# Altium schematic sheet OTHER.SchDoc: OTHER
size A4; DrawnBy: ThanhQuoc; Revision: V01; SheetNumber: 21; SheetTotal: 21; Project: RV1126 CAMERA BOARD DESIGN
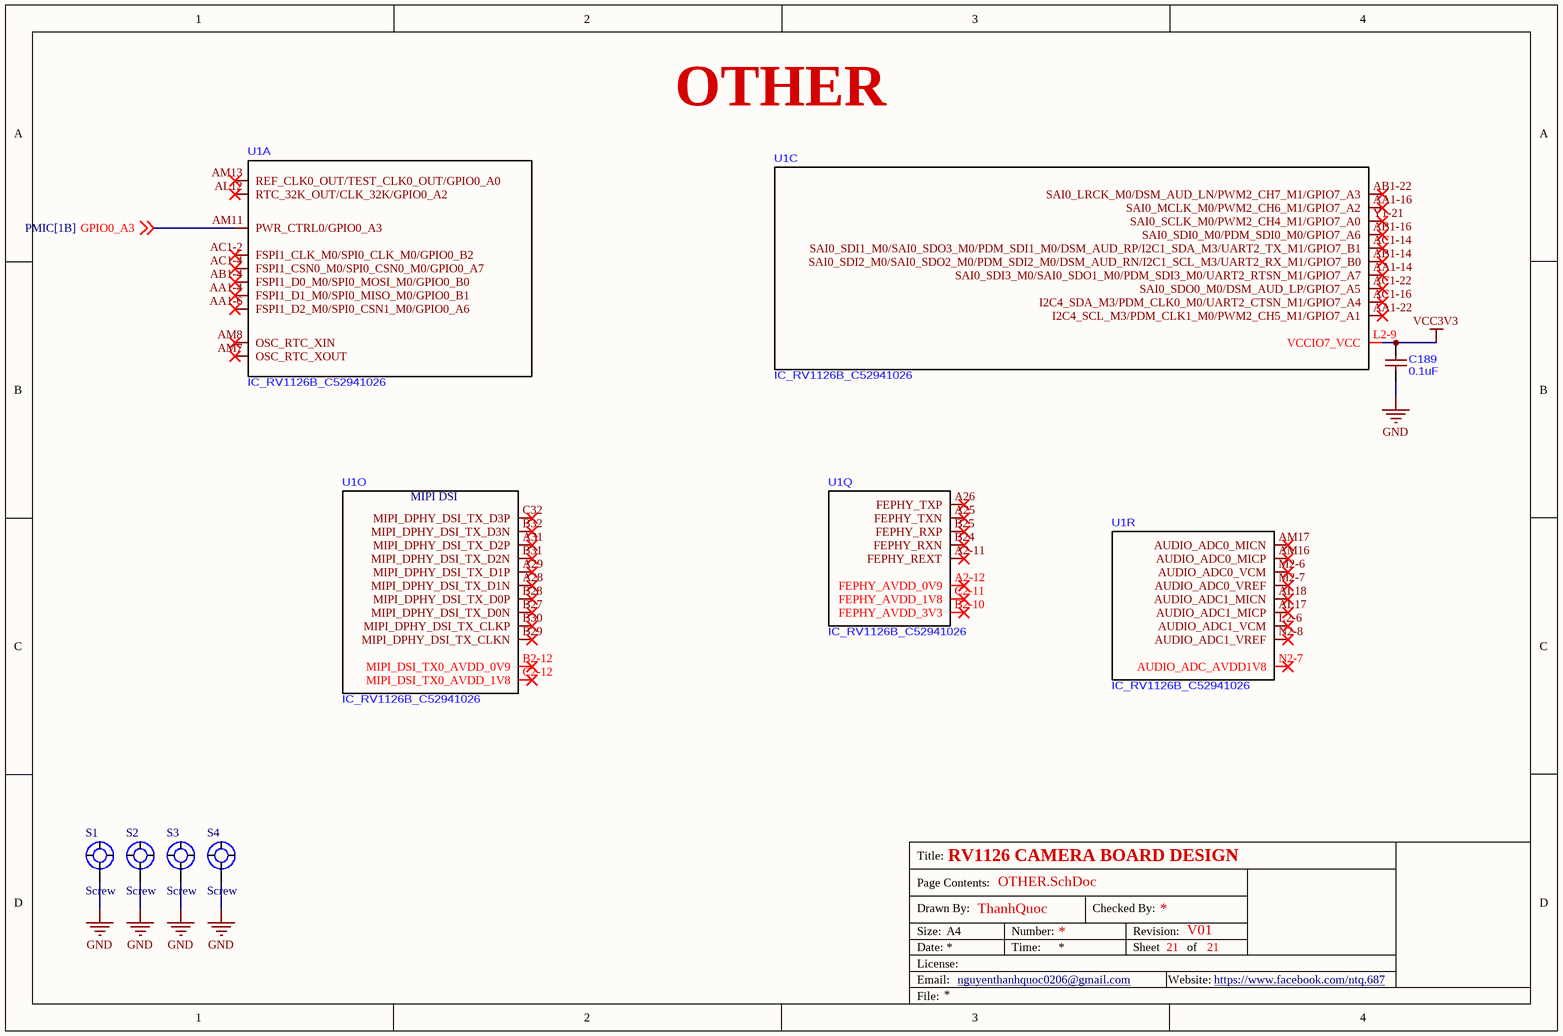
[diagram p0: OTHER.SchDoc]

## Parts
C189  0.1uF  [C0201]
S1  Screw  [SCREW 3.0]
S2  Screw  [SCREW 3.0]
S3  Screw  [SCREW 3.0]
S4  Screw  [SCREW 3.0]
U1  IC_RV1126B_C52941026  [CCSP-491_L14.0-W14.0-TL_RV1126B]  (parts A,C,O,Q,R of 18)

## Nets
GND: C189.1 S1.1 S2.1 S3.1 S4.1
VCC3V3: C189.2 U1.L2-9(VCCIO7_VCC)
GPIO0_A3: U1.AM11(PWR_CTRL0/GPIO0_A3) ; off-sheet GPIO0_A3

Not connected (* = marked no-connect by the designer): U1 A2-11(FEPHY_REXT)* A2-12(FEPHY_AVDD_0V9)* A25(FEPHY_TXN)* A26(FEPHY_TXP)* A28(MIPI_DPHY_DSI_TX_D1N)* A29(MIPI_DPHY_DSI_TX_D1P)* A31(MIPI_DPHY_DSI_TX_D2P)* AA1-4(FSPI1_D1_M0/SPI0_MISO_M0/GPIO0_B1)* AA1-6(FSPI1_D2_M0/SPI0_CSN1_M0/GPIO0_A6)* AA1-14(SAI0_SDI3_M0/SAI0_SDO1_M0/PDM_SDI3_M0/UART2_RTSN_M1/GPIO7_A7)* AA1-16(SAI0_MCLK_M0/PWM2_CH6_M1/GPIO7_A2)* AA1-22(I2C4_SCL_M3/PDM_CLK1_M0/PWM2_CH5_M1/GPIO7_A1)* AB1-4(FSPI1_D0_M0/SPI0_MOSI_M0/GPIO0_B0)* AB1-14(SAI0_SDI2_M0/SAI0_SDO2_M0/PDM_SDI2_M0/DSM_AUD_RN/I2C1_SCL_M3/UART2_RX_M1/GPIO7_B0)* AB1-16(SAI0_SDI0_M0/PDM_SDI0_M0/GPIO7_A6)* AB1-22(SAI0_LRCK_M0/DSM_AUD_LN/PWM2_CH7_M1/GPIO7_A3)* AC1-2(FSPI1_CLK_M0/SPI0_CLK_M0/GPIO0_B2)* AC1-4(FSPI1_CSN0_M0/SPI0_CSN0_M0/GPIO0_A7)* AC1-14(SAI0_SDI1_M0/SAI0_SDO3_M0/PDM_SDI1_M0/DSM_AUD_RP/I2C1_SDA_M3/UART2_TX_M1/GPIO7_B1)* AC1-16(I2C4_SDA_M3/PDM_CLK0_M0/UART2_CTSN_M1/GPIO7_A4)* AC1-22(SAI0_SDO0_M0/DSM_AUD_LP/GPIO7_A5)* AL12(RTC_32K_OUT/CLK_32K/GPIO0_A2)* AL17(AUDIO_ADC1_MICP)* AL18(AUDIO_ADC1_MICN)* AM7(OSC_RTC_XOUT)* AM8(OSC_RTC_XIN)* AM13(REF_CLK0_OUT/TEST_CLK0_OUT/GPIO0_A0)* AM16(AUDIO_ADC0_MICP)* AM17(AUDIO_ADC0_MICN)* B2-10(FEPHY_AVDD_3V3)* B2-12(MIPI_DSI_TX0_AVDD_0V9)* B24(FEPHY_RXN)* B25(FEPHY_RXP)* B27(MIPI_DPHY_DSI_TX_D0N)* B28(MIPI_DPHY_DSI_TX_D0P)* B29(MIPI_DPHY_DSI_TX_CLKN)* B30(MIPI_DPHY_DSI_TX_CLKP)* B31(MIPI_DPHY_DSI_TX_D2N)* B32(MIPI_DPHY_DSI_TX_D3N)* C2-11(FEPHY_AVDD_1V8)* C2-12(MIPI_DSI_TX0_AVDD_1V8)* C32(MIPI_DPHY_DSI_TX_D3P)* L2-6(AUDIO_ADC1_VCM)* M2-6(AUDIO_ADC0_VCM)* M2-7(AUDIO_ADC0_VREF)* N2-7(AUDIO_ADC_AVDD1V8)* N2-8(AUDIO_ADC1_VREF)* Y1-21(SAI0_SCLK_M0/PWM2_CH4_M1/GPIO7_A0)*

## Notes on the sheet
- Title:
- Drawn By:
- Page Contents:
- Checked By:
- Size:
- Date:
- File:
- License:
- Email:
- A4
- nguyenthanhquoc0206@gmail.com
- Number:
- Time:
- Revision:
- Sheet
- Website:
- of
- https://www.facebook.com/ntq.687
- (in symbol IC_RV1126B_C52941026, part O) MIPI DSI

## Library data of the parts
C189 = CAP_100nF-6.3V-10%-0201_1: 0.1uF ±10% 6.3V Ceramic Capacitor X5R 0201